# EAGLE design Relay Drivers (EAGLE 9.6.2)
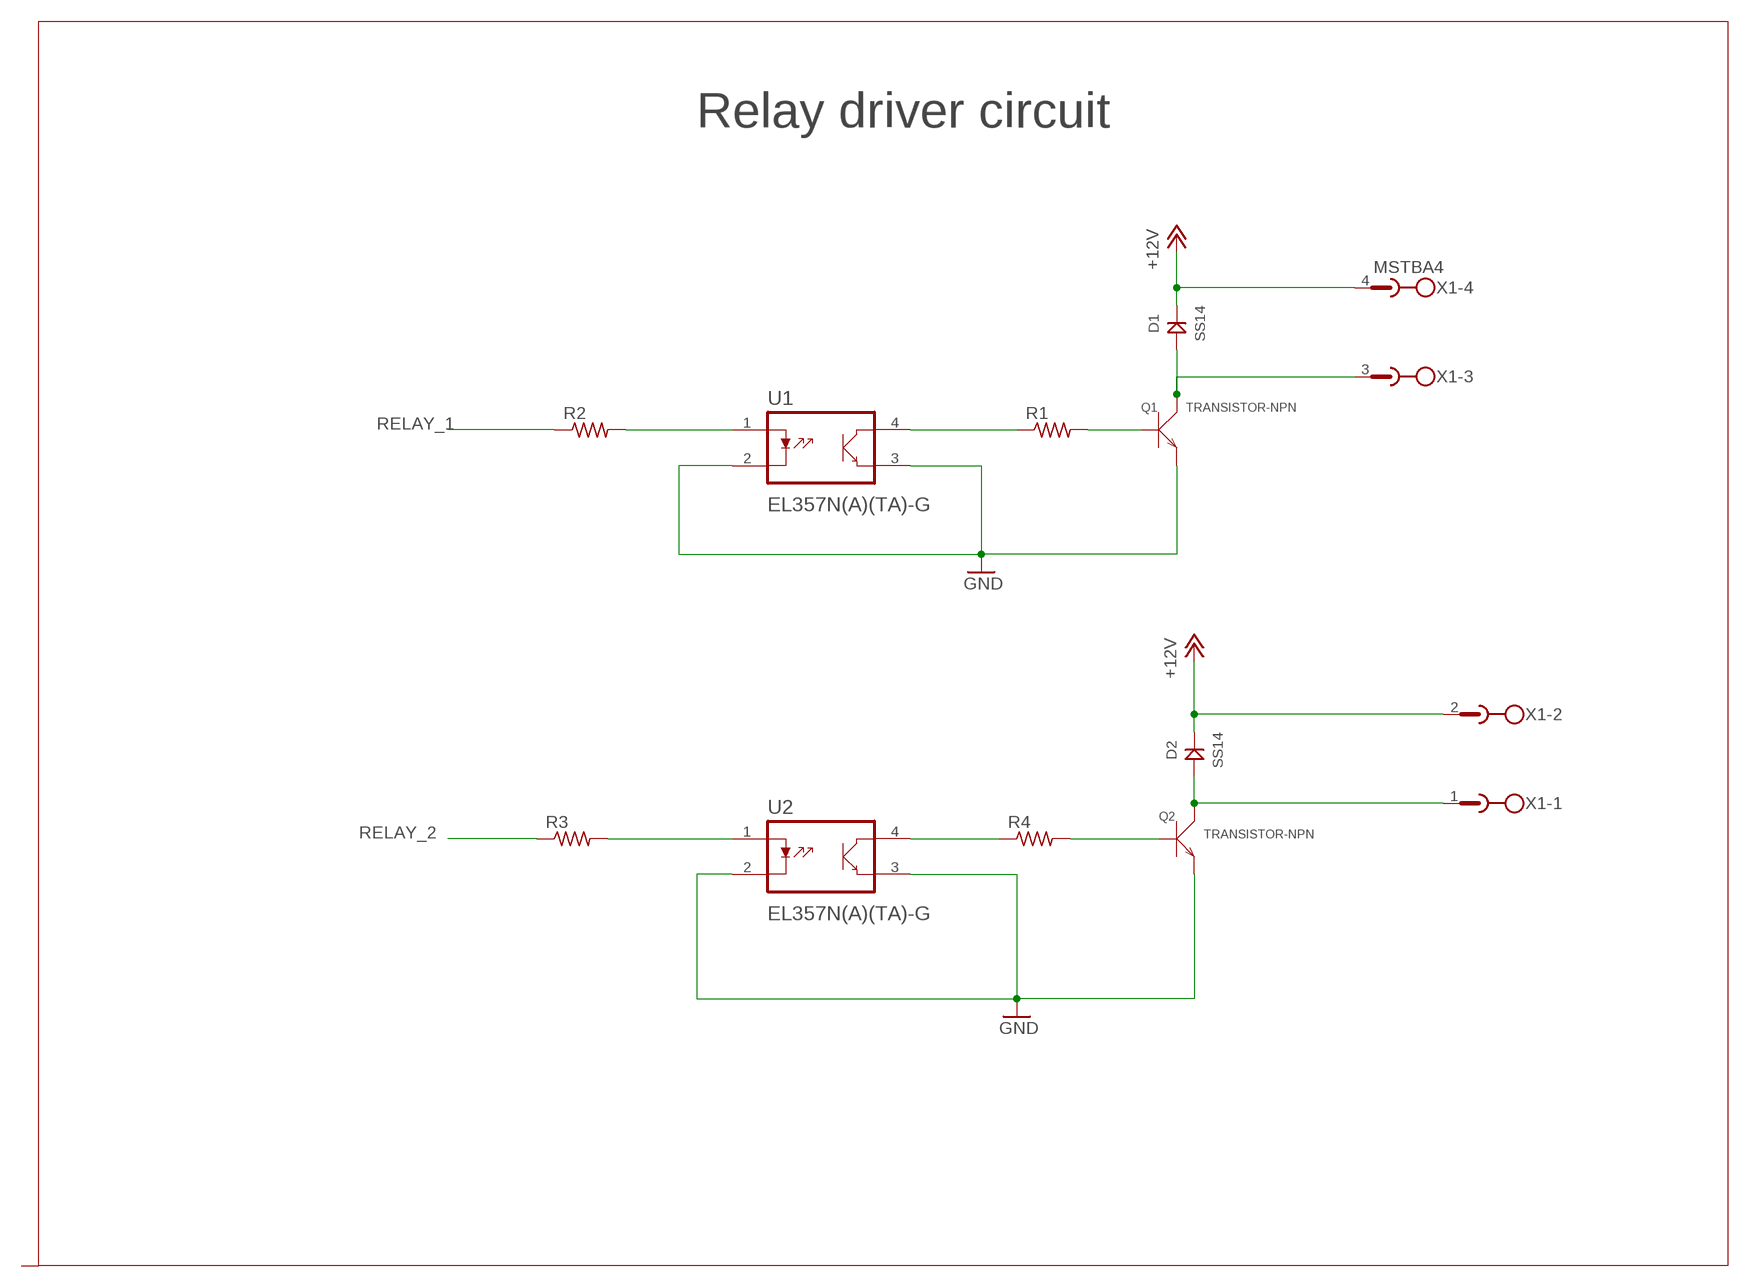
[diagram p0: schematic, sheet 1]

## Parts
D1  SS14  [DO214]
D2  SS14  [DO214]
Q1  TRANSISTOR-NPN  [SOT-23]
Q2  TRANSISTOR-NPN  [SOT-23]
R1  R-US_R0805  [R0805]
R2  R-US_R0805  [R0805]
R3  R-US_R0805  [R0805]
R4  R-US_R0805  [R0805]
U1  EL357N(A)(TA)-G  [SOP254P700X200-4N]
U2  EL357N(A)(TA)-G  [SOP254P700X200-4N]
X1  MSTBA4  [MSTBA4]

## Nets
+12V: D1.CATHODE(KATHODE) D2.CATHODE(KATHODE) X1.2 X1.4
GND: Q1.2(E) Q2.2(E) U1.2(K) U1.3(E) U2.2(K) U2.3(E)
N$1: R2.2 U1.1(A)
N$2: R1.1 U1.4(C)
N$3: Q1.1(B) R1.2
N$4: D1.ANODE Q1.3(C) X1.3
N$5: R3.2 U2.1(A)
N$8: R4.1 U2.4(C)
N$9: Q2.1(B) R4.2
N$10: D2.ANODE Q2.3(C) X1.1
RELAY_1: R2.1
RELAY_2: R3.1

## Notes on the sheet
- Relay driver circuit

## Library data of the parts
D1 D2 = PC_Diode_SS14:SS14; AVAILABILITY: Unavailable; DESCRIPTION: SS14 Series 500 mV 1 A 40 V Max Reverse Voltage Schottky Rectifier - DO-214AC; MF: ON Semiconductor; MP: SS14; PACKAGE: DO-214AC-214 ON Semiconductor; PRICE: None
Q1 Q2 = PC_Transistor_BC817:TRANSISTOR-NPN*: NPN Transistor; AVAILABILITY: Unavailable; DESCRIPTION: PS NPN transistor BC817-40 0.5A Ic 1Vce; MF: STMicroelectronics; MP: BC817-40; PACKAGE: SOT-23 NXP Semiconductors; PRICE: None
R1-R4 = rcl:R-US_: RESISTOR, American symbol; SPICEPREFIX: R
U1 U2 = PC_Optocoupler_EL357:EL357N(A)(TA)-G: Optocoupler [Everlight Electronics] EL357N(A)(TA)-G Optocoupler; AVAILABILITY: Unavailable; DESCRIPTION: Optocoupler [Everlight Electronics] EL357N_A__TA_-G Optocoupler; MF: Everlight; MP: EL357N_A__TA_-G; PACKAGE: SOP-4 Everlight; PRICE: None
X1 = con-phoenix-508:MSTBA4: PHOENIX; MF: FARNELL; MPN: 1757268; OC_FARNELL: 3705195; OC_NEWARK: 71C4163

## Board
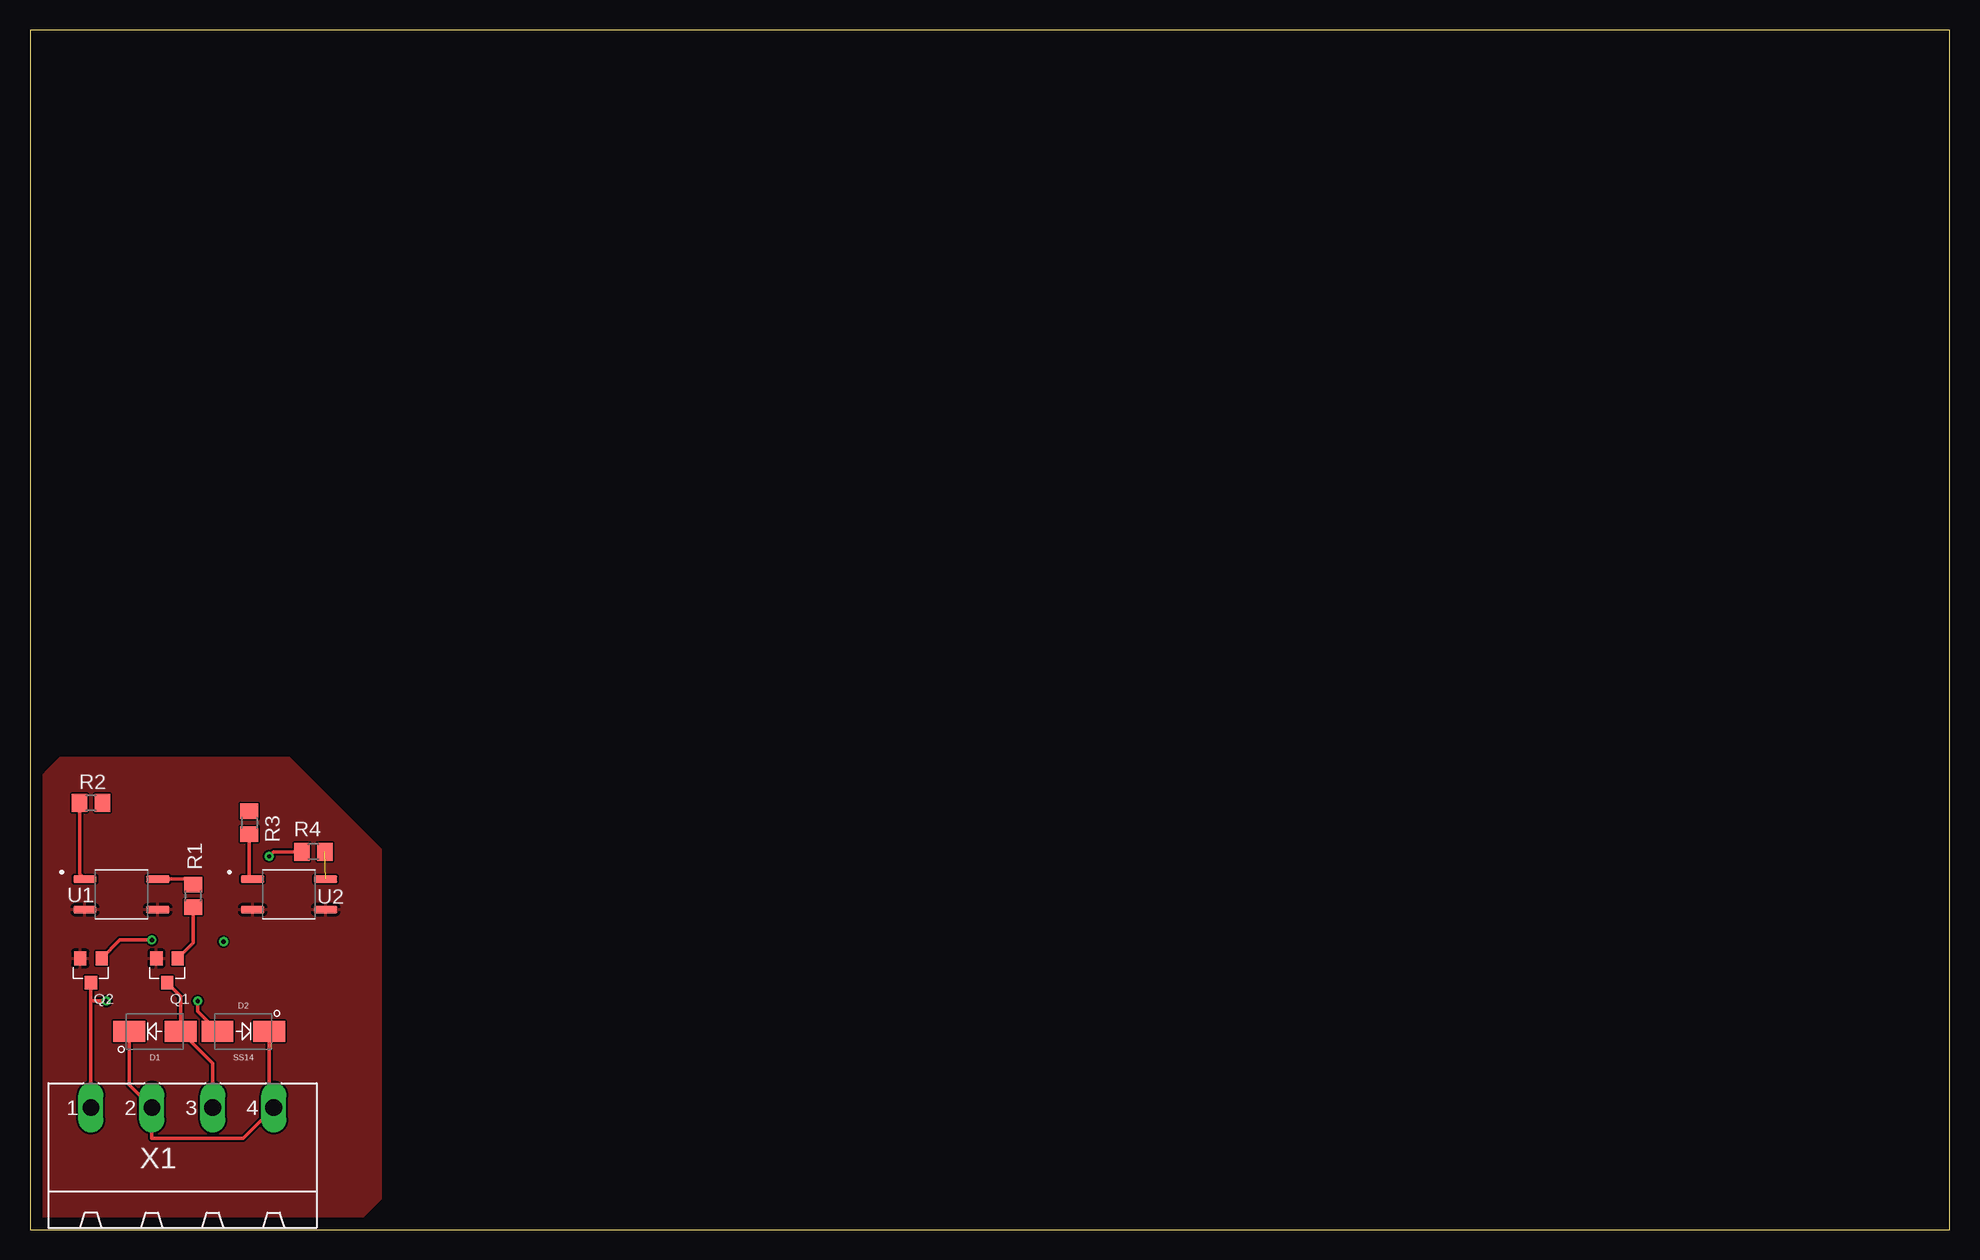
[diagram p1: board, top side]
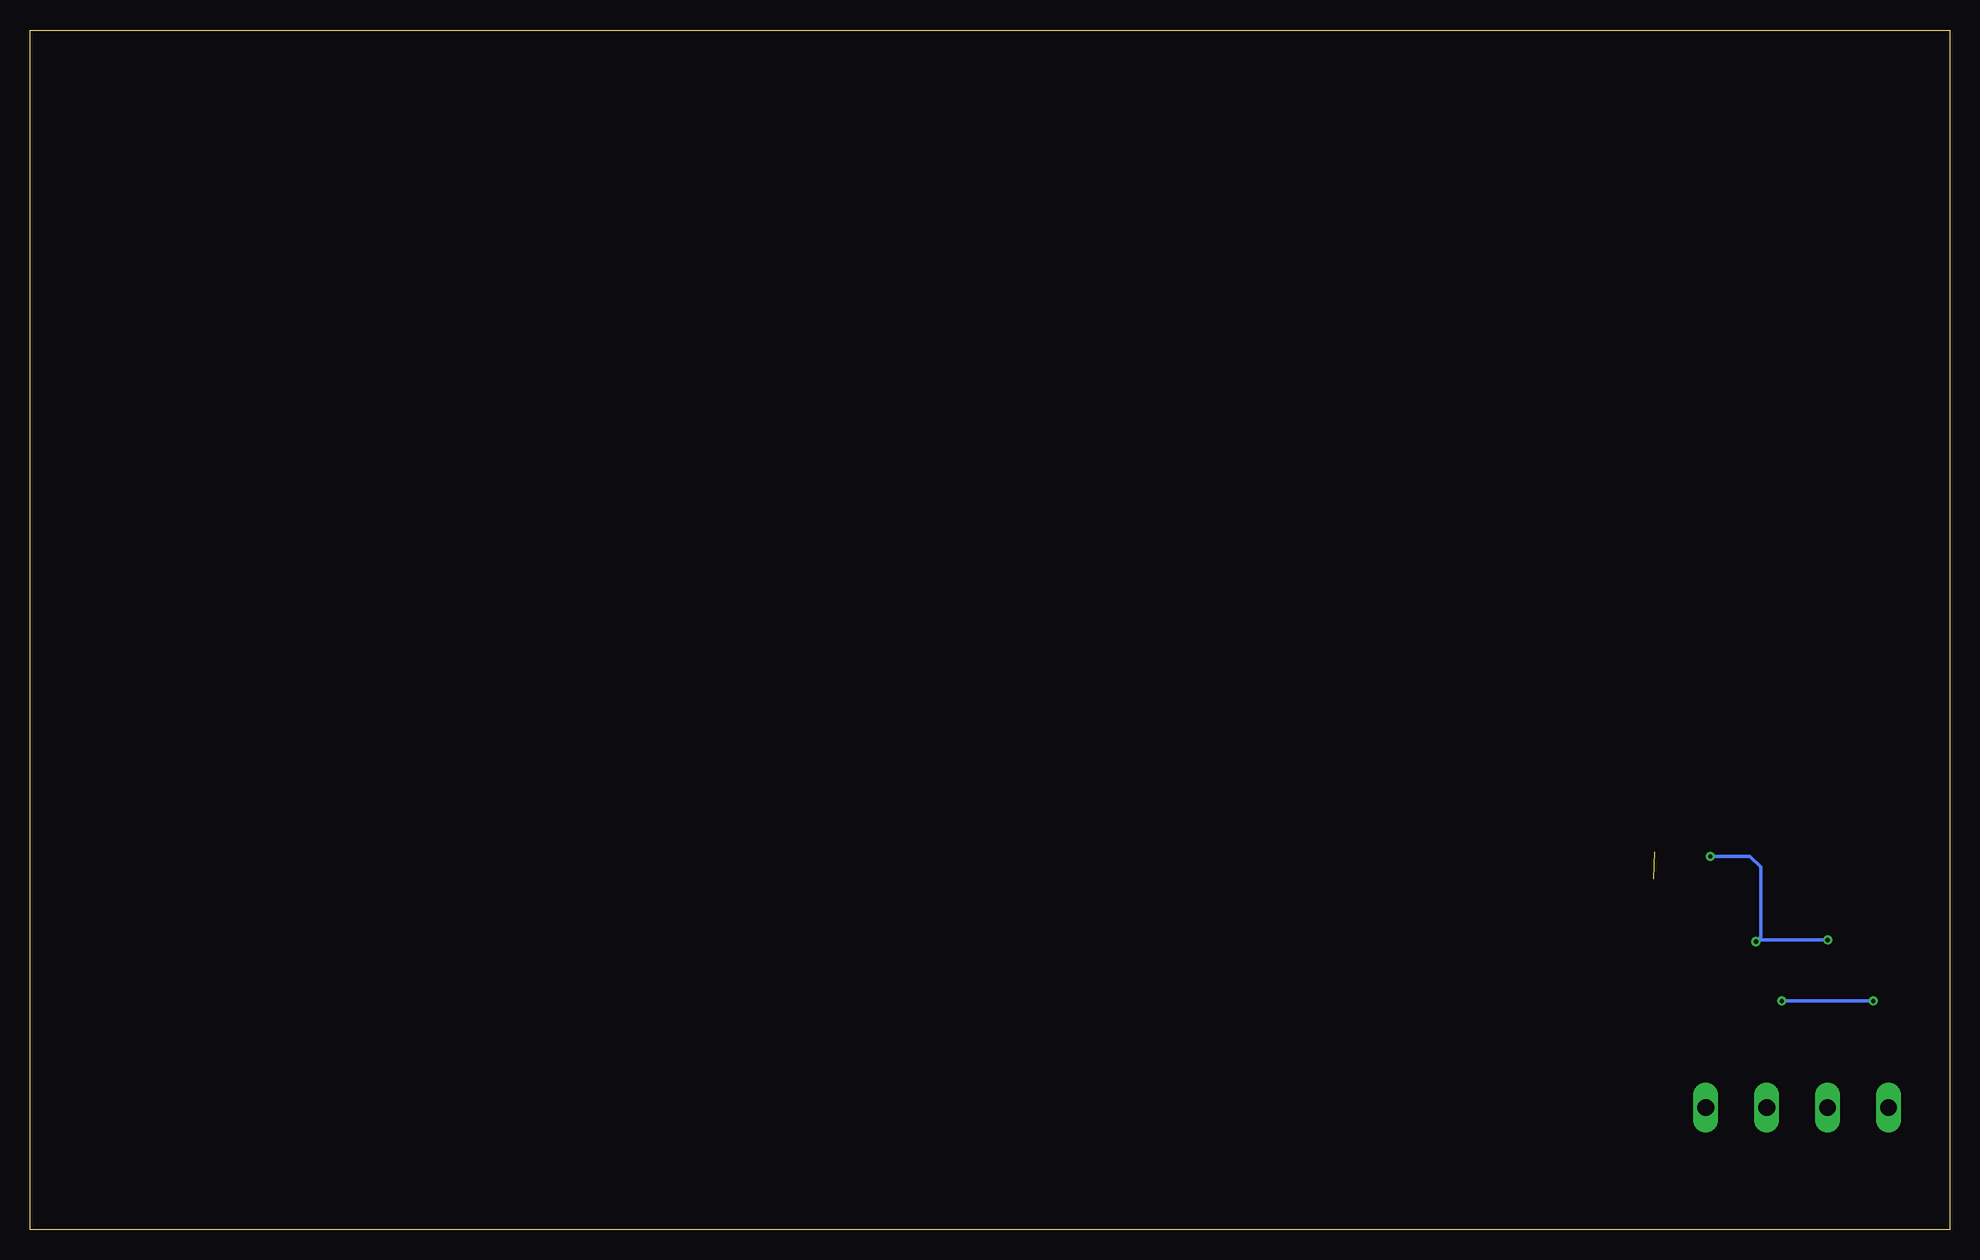
[diagram p2: board, bottom side, seen from below]

Size 160 x 100 mm. Coordinates in mm from the lower left corner, seen from the top.
Outline: 0,0 160,0 160,100 0,100 0,0
Copper layers (1*16): Top 0.035mm / dielectric 1.5mm / Bottom 0.035mm
Design rules "default": minimum track width 6mil, minimum drill 0.35mm, track to track 6mil, track to pad 6mil, pad to pad 6mil, via to via 6mil, smd to smd 6mil, copper to edge 40mil, drill to drill 6mil, minimum pad ring 10mil, minimum via ring 8mil, stop-mask expansion 4mil, vias tented up to drill 0mil, thermal gap 10mil

### Footprints (pad centres in the part's own frame; a part is rotated, then mirrored left to right if it is on the bottom)
DO214 = smd 2.65 x 1.75: ANODE -2.15,0; CATHODE 2.15,0
SOT-23 = smd 1.016 x 1.143: 1 -0.889,-1.016; 2 0.889,-1.016; 3 0,1.016
R0805 = smd 1.3 x 1.5: 1 -0.95,0; 2 0.95,0
SOP254P700X200-4N = smd 1.93 x 0.59: 1 -3.04,1.27; 2 -3.04,-1.27; 3 3.04,-1.27; 4 3.04,1.27
MSTBA4 = drill 1.397 long: 1 -7.62,5.08; 2 -2.54,5.08; 3 2.54,5.08; 4 7.62,5.08

### Placement (x,y rotation side)
D1  10.41,16.51 180 top
D2  17.78,16.51 0 top
Q1  11.43,21.59 180 top
Q2  5.08,21.59 180 top
R1  13.59,27.81 270 top
R2  5.08,35.56 180 top
R3  18.29,33.91 270 top
R4  23.62,31.5 180 top
U1  7.62,27.94 0 top
U2  21.59,27.94 0 top
X1  12.7,5.08 0 top

### Tracks (layer width: path | path; a pad name or v marks a point on that pad's centre or on a via)
+12V
  Top 0.305: D2.CATHODE 19.93,10.55 X1.4 17.78,7.62 10.16,7.62 X1.2 8.26,12.06 D1.CATHODE
GND
  pour Top: 2.54,39.37 21.59,39.37 29.21,31.75 29.21,2.54 26.67,0 0,0 0,36.83
N$1
  Top 0.305: R2.2 4.13,29.66 U1.1
N$2
  Top 0.305: U1.4 13.14,29.21 R1.1
N$3
  Top 0.305: Q1.1 13.59,23.88 R1.2
N$4
  Top 0.305: X1.3 15.24,13.83 D1.ANODE 12.56,19.44 Q1.3
N$5
  Top 0.305: R3.2 18.29,29.47 U2.1
N$8  (1 unrouted)
N$9  (via drill 0.35)
  Top 0.305: R4.2 20.32,31.5 v19.94,31.11 | Q2.1 7.49,24.13 v10.16,24.13
  Bottom 0.305: v19.94,31.11 16.64,31.11 15.75,30.23 15.75,24.38 v16.13,24 16,24.13 v10.16,24.13
N$10  (via drill 0.35)
  Top 0.305: Q2.3 5.08,19.05 | 5.08,19.05 X1.1 | D2.ANODE 13.97,18.17 v13.97,19.05 | v6.35,19.05 5.08,19.05
  Bottom 0.305: v13.97,19.05 v6.35,19.05